# Altium project 手动分控1.0PCB_Project.PrjPcb
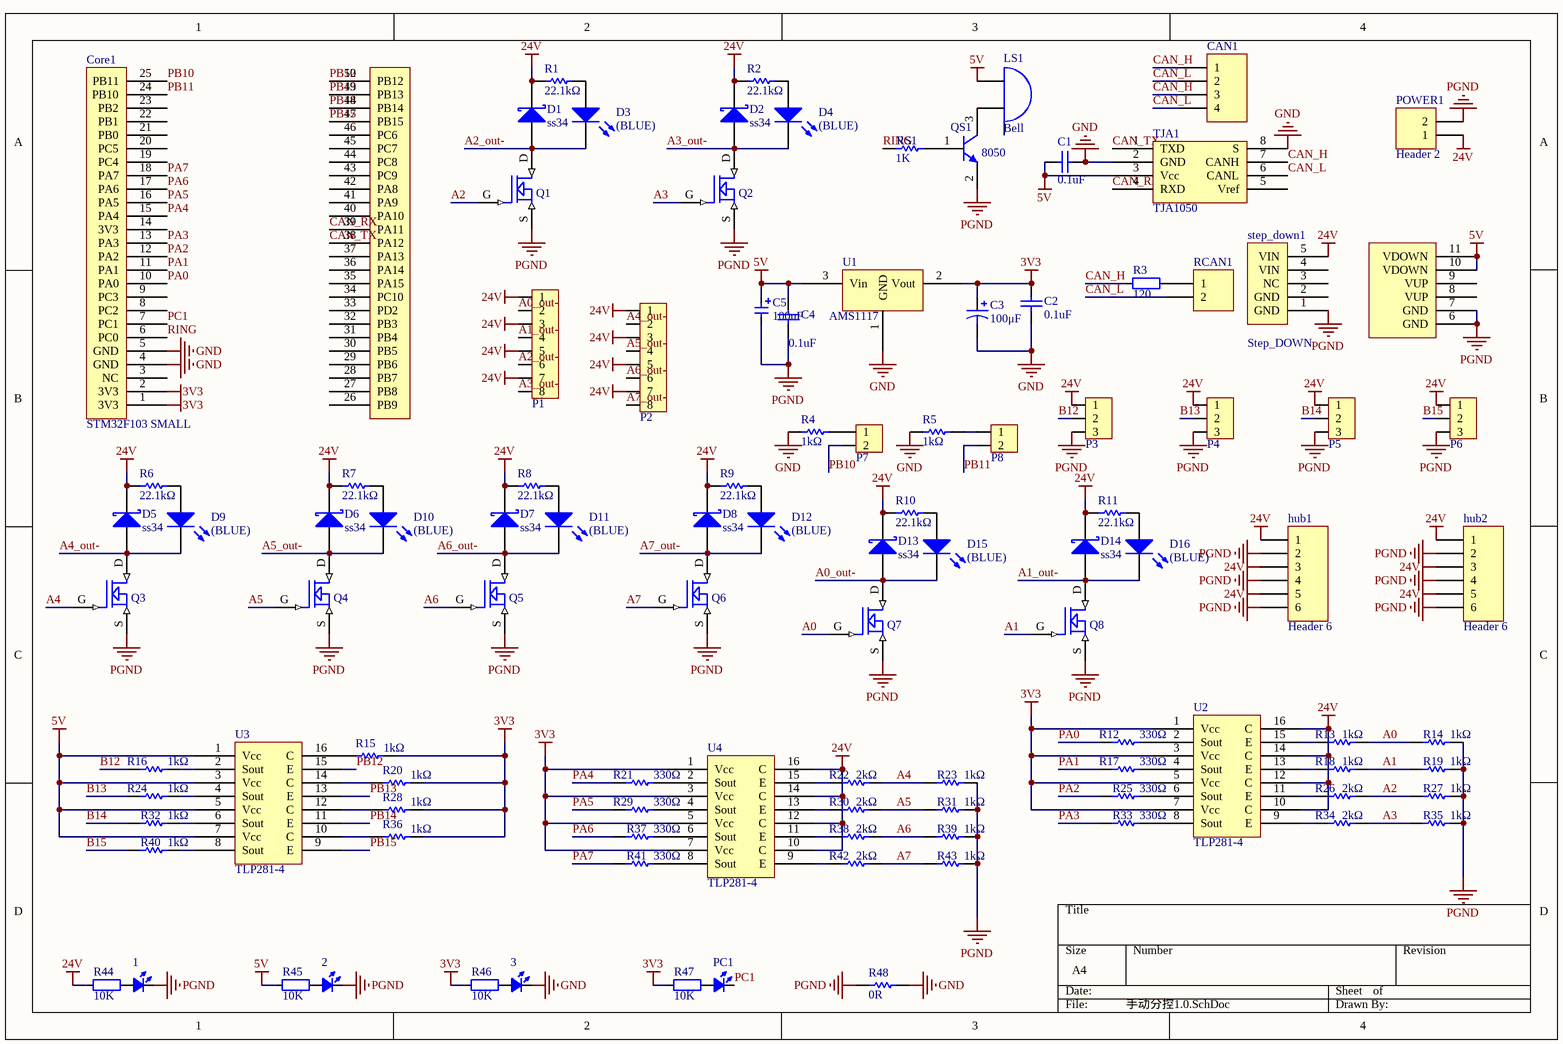
[diagram p0: 手动分控1.0.SchDoc]
1 sheet, 104 parts. Net scope: global (net labels, ports and power ports of the same name join across sheets).
Board file: 手动分控1.0F.PcbDoc

## Sheet 手动分控1.0.SchDoc
size A4

### Parts
1  LED_0603  [LED_0805_GREEN]  (value not drawn)
2  LED_0603  [LED_0805_GREEN]  (value not drawn)
3  LED_0603  [LED_0805_GREEN]  (value not drawn)
C1  value 0.1uF  [CAP-MLCC-0603]  (hidden comment: Cap)
C2  value 0.1uF  [CAP-MLCC-0603]  (hidden comment: Cap)
C3  100μF  [CAP-TAN-3216/CAPA]
C4  value 0.1uF  [CAP-MLCC-0603]  (hidden comment: Cap)
C5  value 100uF  [CAP-TAN-6032/CAPC]  (hidden comment: Cap_Tan_0805)
CAN1  Header 4  [Green_4P]  (value not drawn)
Core1  STM32F103 SMALL  [STM32F103Small]
D1  ss34  [ss34]
D2  ss34  [ss34]
D3  (BLUE)  [LED-0805]
D4  (BLUE)  [LED-0805]
D5  ss34  [ss34]
D6  ss34  [ss34]
D7  ss34  [ss34]
D8  ss34  [ss34]
D9  (BLUE)  [LED-0805]
D10  (BLUE)  [LED-0805]
D11  (BLUE)  [LED-0805]
D12  (BLUE)  [LED-0805]
D13  ss34  [ss34]
D14  ss34  [ss34]
D15  (BLUE)  [LED-0805]
D16  (BLUE)  [LED-0805]
hub1  Header 6  [Green_6P]
hub2  Header 6  [Green_6P]
LS1  Bell  [CAP-ELE-PIN200/DIA250]
P1  HDR1x8_1.27  [HDR1X8_1.27_180]  (value not drawn)
P2  HDR1x8_1.27  [HDR1X8_1.27_180]  (value not drawn)
P3  HDR1x3_2.54  [Green_3P]  (value not drawn)
P4  HDR1x3_2.54  [Green_3P]  (value not drawn)
P5  HDR1x3_2.54  [Green_3P]  (value not drawn)
P6  HDR1x3_2.54  [Green_3P]  (value not drawn)
P7  HDR1x2_2.54  [Green_2P]  (value not drawn)
P8  HDR1x2_2.54  [Green_2P]  (value not drawn)
PC1  LED_0603  [LED_0805_GREEN]  (value not drawn)
POWER1  Header 2  [Green_2P]
Q1  MOSFET N  [NMOS_SOT23]  (value not drawn)
Q2  MOSFET N  [NMOS_SOT23]  (value not drawn)
Q3  MOSFET N  [NMOS_SOT23]  (value not drawn)
Q4  MOSFET N  [NMOS_SOT23]  (value not drawn)
Q5  MOSFET N  [NMOS_SOT23]  (value not drawn)
Q6  MOSFET N  [NMOS_SOT23]  (value not drawn)
Q7  MOSFET N  [LR7843]  (value not drawn)
Q8  MOSFET N  [LR7843]  (value not drawn)
QS1  8050  [SOT-23B_N]
R1  22.1kΩ  [RES-0603]
R2  22.1kΩ  [RES-0603]
R3  value 120  [RES-0603]  (hidden comment: Res_0603)
R4  1kΩ  [RES-0603]
R5  1kΩ  [RES-0603]
R6  22.1kΩ  [RES-0603]
R7  22.1kΩ  [RES-0603]
R8  22.1kΩ  [RES-0603]
R9  22.1kΩ  [RES-0603]
R10  22.1kΩ  [RES-0603]
R11  22.1kΩ  [RES-0603]
R12  value 330Ω  [RES-0603]  (hidden comment: RES)
R13  1kΩ  [RES-0603]
R14  1kΩ  [RES-0603]
R15  value 1kΩ  [RES-0603]  (hidden comment: RES)
R16  value 1kΩ  [RES-0603]  (hidden comment: RES)
R17  value 330Ω  [RES-0603]  (hidden comment: RES)
R18  1kΩ  [RES-0603]
R19  1kΩ  [RES-0603]
R20  value 1kΩ  [RES-0603]  (hidden comment: RES)
R21  value 330Ω  [RES-0603]  (hidden comment: RES)
R22  2kΩ  [RES-0603]
R23  1kΩ  [RES-0603]
R24  value 1kΩ  [RES-0603]  (hidden comment: RES)
R25  330Ω  [RES-0603]
R26  2kΩ  [RES-0603]
R27  1kΩ  [RES-0603]
R28  value 1kΩ  [RES-0603]  (hidden comment: RES)
R29  value 330Ω  [RES-0603]  (hidden comment: RES)
R30  2kΩ  [RES-0603]
R31  1kΩ  [RES-0603]
R32  1kΩ  [RES-0603]
R33  330Ω  [RES-0603]
R34  2kΩ  [RES-0603]
R35  1kΩ  [RES-0603]
R36  value 1kΩ  [RES-0603]  (hidden comment: RES)
R37  330Ω  [RES-0603]
R38  2kΩ  [RES-0603]
R39  1kΩ  [RES-0603]
R40  1kΩ  [RES-0603]
R41  330Ω  [RES-0603]
R42  2kΩ  [RES-0603]
R43  1kΩ  [RES-0603]
R44  value 10K  [RES-0603]  (hidden comment: Res_0603)
R45  value 10K  [RES-0603]  (hidden comment: Res_0603)
R46  value 10K  [RES-0603]  (hidden comment: Res_0603)
R47  value 10K  [RES-0603]  (hidden comment: Res_0603)
R48  value 0R  [RES-0603]  (hidden comment: Res1)
RCAN1  (no value)  [HDR1X2]
RS1  value 1K  [RES-0603]  (hidden comment: Res1)
step_down1  Step_DOWN  [Step_Up_Down]
TJA1  TJA1050  [TJA1050]
U1  AMS1117  [SOT223-3]
U2  TLP281-4  [SOP16]
U3  TLP281-4  [SOP16]
U4  TLP281-4  [SOP16]

### Nets
3V3: C2.2 C3.1 Core1.1(3V3) Core1.2(3V3) R15.2 R20.2 R28.2 R36.2 R46.2 R47.2 U1.2(Vout) U2.1(Vcc) U2.3(Vcc) U2.5(Vcc) U2.7(Vcc) U4.1(Vcc) U4.3(Vcc) U4.5(Vcc) U4.7(Vcc)
5V: C1.1 C4.2 C5.1 LS1.1(A) R45.2 step_down1.10(VDOWN) step_down1.11(VDOWN) TJA1.3(Vcc) U1.3(Vin) U3.1(Vcc) U3.3(Vcc) U3.5(Vcc) U3.7(Vcc)
24V: D1.K D2.K D5.K D6.K D7.K D8.K D13.K D14.K hub1.1 hub1.3 hub1.5 hub2.1 hub2.3 hub2.5 P1.1 P1.3 P1.5 P1.7 P2.1 P2.3 P2.5 P2.7 P3.1 P4.1 P5.1 P6.1 POWER1.1 R1.2 R2.1 R6.2 R7.1 R8.2 R9.1 R10.2 R11.1 R44.2 step_down1.5(VIN) U2.10(C) U2.12(C) U2.14(C) U2.16(C) U4.10(C) U4.12(C) U4.14(C) U4.16(C)
GND: 3.2(K) C1.2 C2.1 C3.2 Core1.4(GND) Core1.5(GND) R4.1 R5.1 R48.1 TJA1.2(GND) TJA1.8(S) U1.1(GND)
PGND: 1.2(K) 2.2(K) C4.1 C5.2 hub1.2 hub1.4 hub1.6 hub2.2 hub2.4 hub2.6 P3.3 P4.3 P5.3 P6.3 POWER1.2 Q1.S Q2.S Q3.S Q4.S Q5.S Q6.S Q7.S Q8.S QS1.2(E) R14.1 R19.1 R23.1 R27.1 R31.1 R35.1 R39.1 R43.1 R48.2 step_down1.1(GND) step_down1.6(GND) step_down1.7(GND)
A0: Q7.G R13.2 R14.2
A0_out-: D13.A D15.2(K) P1.2 Q7.D
A1: Q8.G R18.2 R19.2
A1_out-: D14.A D16.2(K) P1.4 Q8.D
A2: Q1.G R26.2 R27.2
A2_out-: D1.A D3.2(K) P1.6 Q1.D
A3: Q2.G R34.2 R35.2
A3_out-: D2.A D4.2(K) P1.8 Q2.D
A4: Q3.G R22.2 R23.2
A4_out-: D5.A D9.2(K) P2.2 Q3.D
A5: Q4.G R30.2 R31.2
A5_out-: D6.A D10.2(K) P2.4 Q4.D
A6: Q5.G R38.2 R39.2
A6_out-: D7.A D11.2(K) P2.6 Q5.D
A7: Q6.G R42.2 R43.2
A7_out-: D8.A D12.2(K) P2.8 Q6.D
B12: P3.2 R16.1
B13: P4.2 R24.1
B14: P5.2 R32.1
B15: P6.2 R40.1
CAN_H: CAN1.1 CAN1.3 R3.2 TJA1.7(CANH)
CAN_L: CAN1.2 CAN1.4 RCAN1.2 TJA1.6(CANL)
CAN_RX: Core1.39(PA11) TJA1.4(RXD)
CAN_TX: Core1.38(PA12) TJA1.1(TXD)
PA0: Core1.10(PA0) R12.1
PA1: Core1.11(PA1) R17.1
PA2: Core1.12(PA2) R25.1
PA3: Core1.13(PA3) R33.1
PA4: Core1.15(PA4) R21.1
PA5: Core1.16(PA5) R29.1
PA6: Core1.17(PA6) R37.1
PA7: Core1.18(PA7) R41.1
PB10: Core1.25(PB11) P7.2
PB11: Core1.24(PB10) P8.2
PB12: Core1.50(PB12) U3.15(E)
PB13: Core1.49(PB13) U3.13(E)
PB14: Core1.48(PB14) U3.11(E)
PB15: Core1.47(PB15) U3.9(E)
PC1: Core1.7(PC1) PC1.2(K)
RING: Core1.6(PC0) RS1.2
Net1_1: 1.1(A) R44.1
Net2_1: 2.1(A) R45.1
Net3_1: 3.1(A) R46.1
NetD3_1: D3.1(A) R1.1
NetD4_1: D4.1(A) R2.2
NetD9_1: D9.1(A) R6.1
NetD10_1: D10.1(A) R7.2
NetD11_1: D11.1(A) R8.1
NetD12_1: D12.1(A) R9.2
NetD15_1: D15.1(A) R10.1
NetD16_1: D16.1(A) R11.2
NetLS1_2: LS1.2(B) QS1.3(C)
NetP7_1: P7.1 R4.2
NetP8_1: P8.1 R5.2
NetPC1_1: PC1.1(A) R47.1
NetQS1_1: QS1.1(B) RS1.1
NetR3_1: R3.1 RCAN1.1
NetR12_2: R12.2 U2.2(Sout)
NetR13_1: R13.1 U2.15(E)
NetR15_1: R15.1 U3.16(C)
NetR16_2: R16.2 U3.2(Sout)
NetR17_2: R17.2 U2.4(Sout)
NetR18_1: R18.1 U2.13(E)
NetR20_1: R20.1 U3.14(C)
NetR21_2: R21.2 U4.2(Sout)
NetR22_1: R22.1 U4.15(E)
NetR24_2: R24.2 U3.4(Sout)
NetR25_2: R25.2 U2.6(Sout)
NetR26_1: R26.1 U2.11(E)
NetR28_1: R28.1 U3.12(C)
NetR29_2: R29.2 U4.4(Sout)
NetR30_1: R30.1 U4.13(E)
NetR32_2: R32.2 U3.6(Sout)
NetR33_2: R33.2 U2.8(Sout)
NetR34_1: R34.1 U2.9(E)
NetR36_1: R36.1 U3.10(C)
NetR37_2: R37.2 U4.6(Sout)
NetR38_1: R38.1 U4.11(E)
NetR40_2: R40.2 U3.8(Sout)
NetR41_2: R41.2 U4.8(Sout)
NetR42_1: R42.1 U4.9(E)

Not connected (* = marked no-connect by the designer): Core1 3(NC) 8(PC2) 9(PC3) 14(3V3) 19(PC4) 20(PC5) 21(PB0) 22(PB1) 23(PB2) 26(PB9) 27(PB8) 28(PB7) 29(PB6) 30(PB5) 31(PB4) 32(PB3) 33(PD2) 34(PC10) 35(PA15) 36(PA14) 37(PA13) 40(PA10) 41(PA9) 42(PA8) 43(PC9) 44(PC8) 45(PC7) 46(PC6); step_down1 2(GND) 3(NC) 4(VIN) 8(VUP) 9(VUP); TJA1 5(Vref)

### Library data of the parts
1-3 PC1 = LED_0603: LED
C1 C2 C4 = Cap: Capacitor; Published: 8-Jun-2000; LatestRevisionDate: 17-Jul-2002; LatestRevisionNote: Re-released for DXP Platform.; PackageReference: RAD-0.3; Publisher: Altium Limited
C3 = CAP-TAN: 钽电容; Value: *μF; Published: 8-Jun-2000; LatestRevisionDate: 17-Jul-2002; LatestRevisionNote: Re-released for DXP Platform.; PackageReference: POLAR0.8; Publisher: Altium Limited; PackageDescription: Polarized Capacitor; 2 Leads
C5 = Cap_Tan_0805: Capacitor
CAN1 = Header 4: Header, 4-Pin; LatestRevisionDate: 17-Jul-2002; LatestRevisionNote: Re-released for DXP Platform.; Publisher: Altium Limited
D1 D2 D5-D8 D13 D14 = DIODE-Schottky: 肖特基二极管; Value: 1N****; Published: 8-Jun-2000; LatestRevisionDate: 17-Jul-2002; LatestRevisionNote: Re-released for DXP Platform.; PackageReference: SMB; Publisher: Altium Limited; PackageDescription: DO-214-AA/SMB; 2 C-Bend Leads; Body 5.3 x 3.6 mm, inc. leads (LxW); Code_JEDEC: DO-214-AA
D3 D4 D9-D12 D15 D16 = LED: Value: (Red); Published: 8-Jun-2000; LatestRevisionDate: 08-Jul-2005; LatestRevisionNote: Mech Layer 1 removed.; PackageReference: LED-1; Publisher: Altium Limited; PackageDescription: LED; 2 Leads
hub1 hub2 = Header 6: Header, 6-Pin; LatestRevisionDate: 17-Jul-2002; LatestRevisionNote: Re-released for DXP Platform.; Publisher: Altium Limited
LS1 = Bell: Electrical Bell; Published: 24-Mar-1999; LatestRevisionDate: 17-Jul-2002; LatestRevisionNote: Re-released for DXP Platform.; PackageReference: PIN2; Publisher: Altium Limited
P1 P2 = HDR1x8_1.27: Header
P3-P6 = HDR1x3_2.54: Header
P7 P8 = HDR1x2_2.54: Header
POWER1 RCAN1 = Header 2: Header, 2-Pin; LatestRevisionDate: 17-Jul-2002; LatestRevisionNote: Re-released for DXP Platform.; Publisher: Altium Limited
Q1-Q8 = MOSFET N: IRF530
QS1 = QNPN: NPN Bipolar Transistor; Published: 8-Jun-2000; LatestRevisionDate: 29-May-2009; LatestRevisionNote: IPC-7351 Footprint Added.; PackageVersion: Aug-1999; PackageReference: SOT-23B; Publisher: Altium Limited; PackageDescription: 3-Pin SOT-23 Package 0.95 mm Pitch, 2.4 mm Lead Span
R1 R2 R4-R11 R13 R14 R18 R19 R22 R23 R25-R27 R30-R35 R37-R43 = RES: 电阻; Value: *kΩ; Published: 8-Jun-2000; LatestRevisionDate: 17-Jul-2002; LatestRevisionNote: Re-released for DXP Platform.; PackageReference: AXIAL-0.3; Publisher: Altium Limited; PackageDescription: Axial Device, Thru-Hole; 2 Leads; 0.3 in Pin Spacing
R3 R44-R47 = Res_0603: Resistor
R12 R15-R17 R20 R21 R24 R28 R29 R36 = RES: 电阻; Published: 8-Jun-2000; LatestRevisionDate: 17-Jul-2002; LatestRevisionNote: Re-released for DXP Platform.; PackageReference: AXIAL-0.3; Publisher: Altium Limited; PackageDescription: Axial Device, Thru-Hole; 2 Leads; 0.3 in Pin Spacing
R48 RS1 = Res1: Resistor; Published: 8-Jun-2000; LatestRevisionDate: 17-Jul-2002; LatestRevisionNote: Re-released for DXP Platform.; PackageReference: AXIAL-0.3; Publisher: Altium Limited
TJA1 = TJA1050: CAN总线收发器
U1 = AMS１１１７
U2-U4 = IC-TLP521-4: TLP521-4,TLP281-4